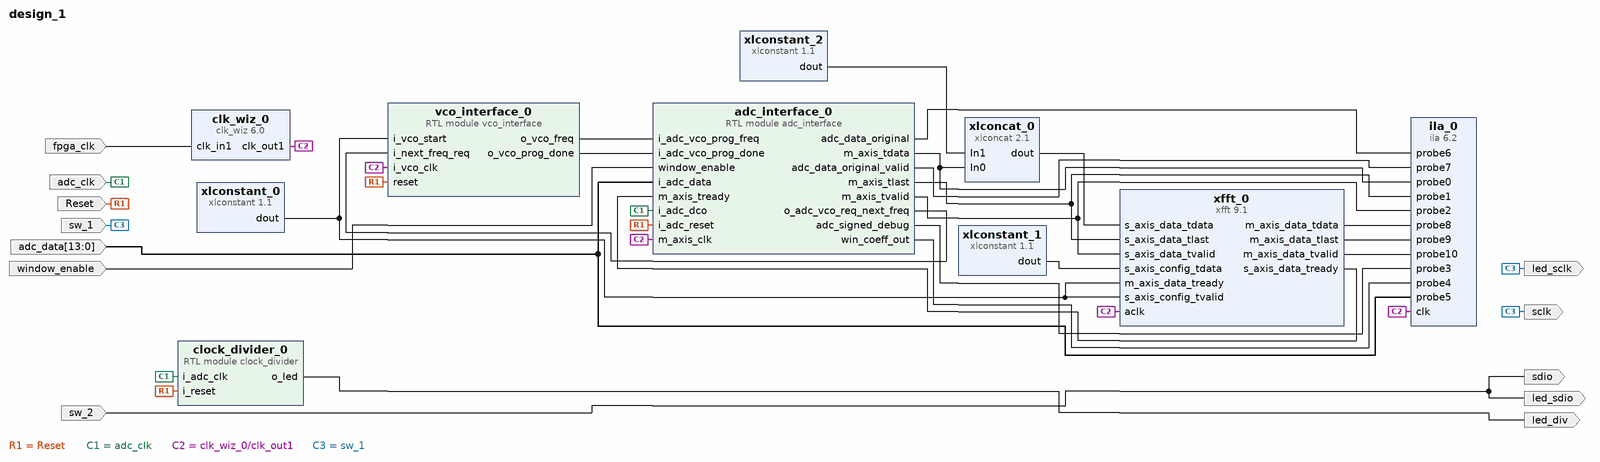
[diagram p0: block diagram of the top level]
# Vivado block design design_1, xc7z020clg484-1, Vivado 2024.2
create_bd_design design_1

create_bd_port -dir I -from 13 -to 0 adc_data
create_bd_port -dir I -type rst Reset
set_property -dict {CONFIG.POLARITY ACTIVE_HIGH} [get_bd_ports Reset]
create_bd_port -dir I -type clk adc_clk
set_property -dict {CONFIG.FREQ_HZ 80000000} [get_bd_ports adc_clk]
create_bd_port -dir I -type clk fpga_clk
set_property -dict {CONFIG.FREQ_HZ 100000000} [get_bd_ports fpga_clk]
create_bd_port -dir I sw_1
create_bd_port -dir I sw_2
create_bd_port -dir O sdio
create_bd_port -dir O sclk
create_bd_port -dir O led_div
create_bd_port -dir O led_sclk
create_bd_port -dir O led_sdio
create_bd_port -dir I window_enable

create_bd_cell -type module -reference adc_interface adc_interface_0
set_property -dict {CONFIG.WIN_EN 0} [get_bd_cells adc_interface_0]
create_bd_cell -type module -reference vco_interface vco_interface_0
create_bd_cell -type ip -vlnv xilinx.com:ip:clk_wiz:6.0 clk_wiz_0
set_property -dict [list \
  CONFIG.CLKOUT1_JITTER 137.143 \
  CONFIG.CLKOUT1_REQUESTED_OUT_FREQ 80 \
  CONFIG.MMCM_CLKOUT0_DIVIDE_F 12.500 \
  CONFIG.USE_LOCKED false \
  CONFIG.USE_RESET false \
] [get_bd_cells clk_wiz_0]
create_bd_cell -type ip -vlnv xilinx.com:ip:xlconstant:1.1 xlconstant_0
create_bd_cell -type module -reference clock_divider clock_divider_0
create_bd_cell -type ip -vlnv xilinx.com:ip:ila:6.2 ila_0
set_property -dict [list \
  CONFIG.C_DATA_DEPTH 4096 \
  CONFIG.C_MONITOR_TYPE Native \
  CONFIG.C_NUM_OF_PROBES 11 \
  CONFIG.C_PROBE0_WIDTH 32 \
  CONFIG.C_PROBE3_WIDTH 16 \
  CONFIG.C_PROBE4_WIDTH 16 \
  CONFIG.C_PROBE5_WIDTH 14 \
  CONFIG.C_PROBE6_WIDTH 14 \
  CONFIG.C_PROBE8_WIDTH 64 \
] [get_bd_cells ila_0]
create_bd_cell -type ip -vlnv xilinx.com:ip:xfft:9.1 xfft_0
set_property -dict [list \
  CONFIG.implementation_options pipelined_streaming_io \
  CONFIG.input_width 32 \
  CONFIG.number_of_stages_using_block_ram_for_data_and_phase_factors 3 \
  CONFIG.output_ordering natural_order \
  CONFIG.target_clock_frequency 80 \
  CONFIG.target_data_throughput 50 \
] [get_bd_cells xfft_0]
create_bd_cell -type ip -vlnv xilinx.com:ip:xlconstant:1.1 xlconstant_1
set_property -dict {CONFIG.CONST_WIDTH 16} [get_bd_cells xlconstant_1]
create_bd_cell -type ip -vlnv xilinx.com:ip:xlconstant:1.1 xlconstant_2
set_property -dict {CONFIG.CONST_VAL 0 CONFIG.CONST_WIDTH 32} [get_bd_cells xlconstant_2]
create_bd_cell -type ip -vlnv xilinx.com:ip:xlconcat:2.1 xlconcat_0
set_property -dict {CONFIG.IN0_WIDTH 32 CONFIG.IN1_WIDTH 32} [get_bd_cells xlconcat_0]

# ---- connections ----

connect_bd_net [get_bd_ports Reset] \
  [get_bd_pins vco_interface_0/reset] [get_bd_pins clock_divider_0/i_reset] [get_bd_pins adc_interface_0/i_adc_reset]
connect_bd_net [get_bd_ports adc_clk] [get_bd_pins clock_divider_0/i_adc_clk] [get_bd_pins adc_interface_0/i_adc_dco]
connect_bd_net [get_bd_pins adc_interface_0/adc_data_original] [get_bd_pins ila_0/probe6]
connect_bd_net [get_bd_pins adc_interface_0/adc_data_original_valid] [get_bd_pins ila_0/probe7]
connect_bd_net [get_bd_pins adc_interface_0/adc_signed_debug] [get_bd_pins ila_0/probe3]
connect_bd_net [get_bd_pins adc_interface_0/m_axis_tdata] [get_bd_pins ila_0/probe0] [get_bd_pins xlconcat_0/In0]
connect_bd_net [get_bd_pins adc_interface_0/m_axis_tlast] [get_bd_pins ila_0/probe1] [get_bd_pins xfft_0/s_axis_data_tlast]
connect_bd_net [get_bd_pins adc_interface_0/m_axis_tvalid] [get_bd_pins ila_0/probe2] [get_bd_pins xfft_0/s_axis_data_tvalid]
connect_bd_net [get_bd_pins adc_interface_0/o_adc_vco_req_next_freq] [get_bd_pins vco_interface_0/i_next_freq_req]
connect_bd_net [get_bd_pins adc_interface_0/win_coeff_out] [get_bd_pins ila_0/probe4]
connect_bd_net [get_bd_pins clk_wiz_0/clk_out1] \
  [get_bd_pins vco_interface_0/i_vco_clk] [get_bd_pins ila_0/clk] [get_bd_pins xfft_0/aclk] \
  [get_bd_pins adc_interface_0/m_axis_clk]
connect_bd_net [get_bd_pins clock_divider_0/o_led] [get_bd_ports led_div]
connect_bd_net [get_bd_ports fpga_clk] [get_bd_pins clk_wiz_0/clk_in1]
connect_bd_net -net i_adc_data_0_1 [get_bd_ports adc_data] [get_bd_pins ila_0/probe5] [get_bd_pins adc_interface_0/i_adc_data]
connect_bd_net -net sw_1_1 [get_bd_ports sw_1] [get_bd_ports sclk] [get_bd_ports led_sclk]
connect_bd_net -net sw_2_1 [get_bd_ports sw_2] [get_bd_ports sdio] [get_bd_ports led_sdio]
connect_bd_net [get_bd_pins vco_interface_0/o_vco_freq] [get_bd_pins adc_interface_0/i_adc_vco_prog_freq]
connect_bd_net [get_bd_pins vco_interface_0/o_vco_prog_done] [get_bd_pins adc_interface_0/i_adc_vco_prog_done]
connect_bd_net -net window_enable_0_1 [get_bd_ports window_enable] [get_bd_pins adc_interface_0/window_enable]
connect_bd_net [get_bd_pins xfft_0/m_axis_data_tdata] [get_bd_pins ila_0/probe8]
connect_bd_net [get_bd_pins xfft_0/m_axis_data_tlast] [get_bd_pins ila_0/probe9]
connect_bd_net [get_bd_pins xfft_0/m_axis_data_tvalid] [get_bd_pins ila_0/probe10]
connect_bd_net [get_bd_pins xfft_0/s_axis_data_tready] [get_bd_pins adc_interface_0/m_axis_tready]
connect_bd_net [get_bd_pins xlconcat_0/dout] [get_bd_pins xfft_0/s_axis_data_tdata]
connect_bd_net [get_bd_pins xlconstant_0/dout] \
  [get_bd_pins vco_interface_0/i_vco_start] [get_bd_pins xfft_0/s_axis_config_tvalid] [get_bd_pins xfft_0/m_axis_data_tready]
connect_bd_net [get_bd_pins xlconstant_1/dout] [get_bd_pins xfft_0/s_axis_config_tdata]
connect_bd_net [get_bd_pins xlconstant_2/dout] [get_bd_pins xlconcat_0/In1]

validate_bd_design
save_bd_design
